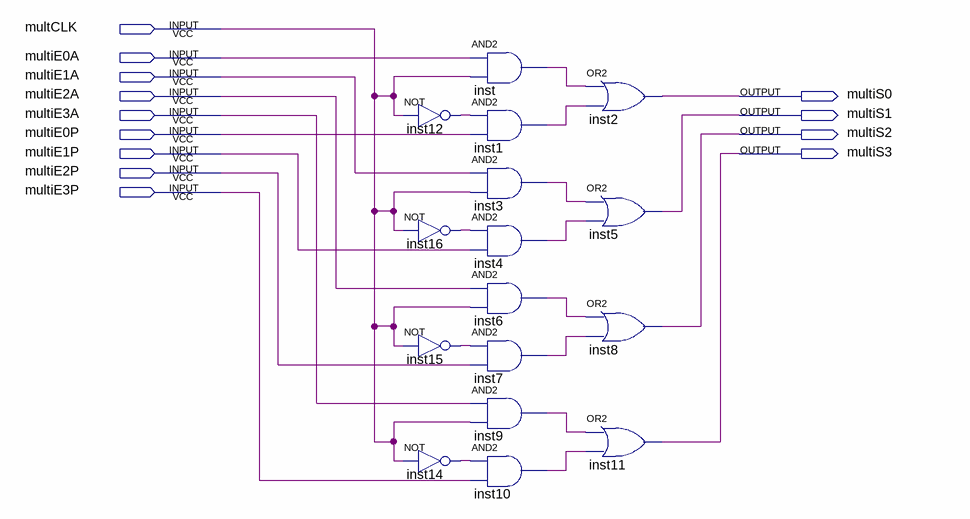
[diagram p0: schematic sheet]
// Quartus schematic multiplesador.bdf as structural Verilog: 16 symbols, 13 pins
module multiplesador (
  input  multCLK,
  input  multiE0A,
  input  multiE1A,
  input  multiE2A,
  input  multiE3A,
  input  multiE0P,
  input  multiE1P,
  input  multiE2P,
  input  multiE3P,
  output multiS0,
  output multiS1,
  output multiS2,
  output multiS3
);

  wire inst1_out, inst3_out, inst4_out, inst6_out, inst7_out, inst9_out, inst10_out, inst12_out, inst14_out,
       inst15_out, inst16_out, inst_out;

  not inst12 (inst12_out, multCLK);
  not inst16 (inst16_out, multCLK);
  not inst15 (inst15_out, multCLK);
  not inst14 (inst14_out, multCLK);
  and inst (inst_out, multiE0A, multCLK);
  and inst1 (inst1_out, inst12_out, multiE0P);
  and inst3 (inst3_out, multiE1A, multCLK);
  and inst4 (inst4_out, inst16_out, multiE1P);
  and inst6 (inst6_out, multiE2A, multCLK);
  and inst7 (inst7_out, inst15_out, multiE2P);
  and inst9 (inst9_out, multiE3A, multCLK);
  and inst10 (inst10_out, inst14_out, multiE3P);
  or inst2 (multiS0, inst_out, inst1_out);
  or inst5 (multiS1, inst3_out, inst4_out);
  or inst8 (multiS2, inst6_out, inst7_out);
  or inst11 (multiS3, inst9_out, inst10_out);
endmodule
